# EAGLE schematic Weather_Sensor_Board (EAGLE 7.4.0)
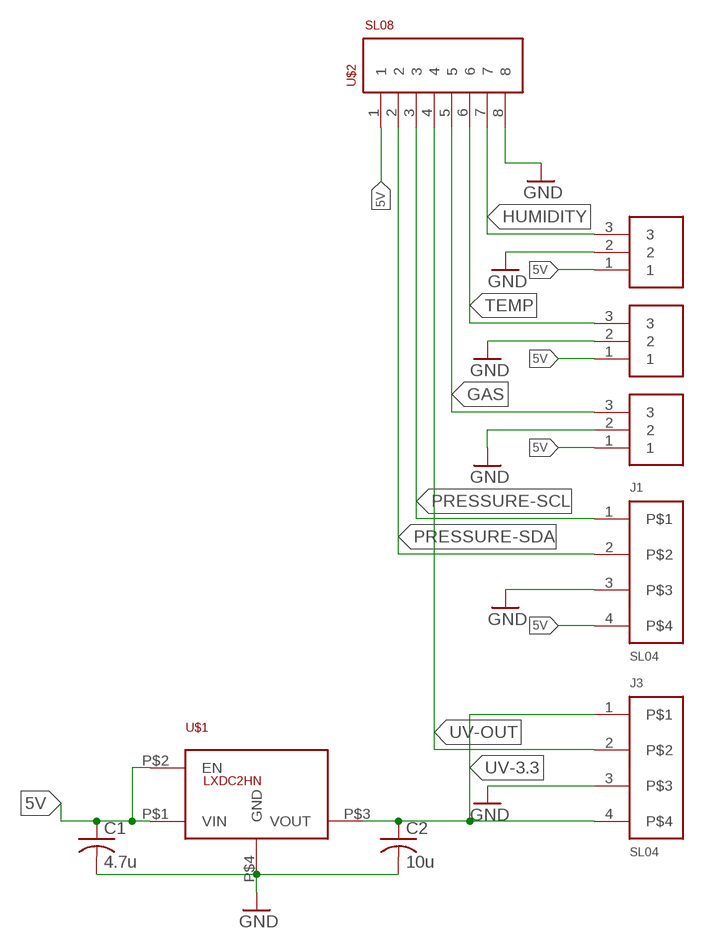
[diagram p0: schematic, sheet 1]

## Parts
C1  4.7u  C-USC0805  [C0805]
C2  10u  C-USC0805  [C0805]
J1  SL04  [MOLEX_SL_04_TH]
J2  SL03THROUGH_HOLE  [MOLEX_SL_03_TH]
J3  SL04  [MOLEX_SL_04_TH]
J4  SL03THROUGH_HOLE  [MOLEX_SL_03_TH]
J5  SL03THROUGH_HOLE  [MOLEX_SL_03_TH]
U$1  LXDC2HN  [4-SMD]
U$2  SL08  [MOLEX-70543-0007]

## Nets
5V: C1.1 J1.4 J2.1 J4.1 J5.1 U$1.P$1(VIN) U$1.P$2(EN)
GAS: J5.3 U$2.5
GND: C1.2 C2.2 J1.3 J2.2 J3.3 J4.2 J5.2 U$1.P$4(GND) U$2.8
HUMIDITY: J2.3 U$2.7
PRESSURE-SCL: J1.1 U$2.3
PRESSURE-SDA: J1.2 U$2.2
TEMP: J4.3 U$2.6
UV-3.3: C2.1 J3.1 J3.4 U$1.P$3(VOUT)
UV-OUT: J3.2 U$2.4
Unconnected: U$2.1

## Library data of the parts
C1 C2 = rcl:C-US: CAPACITOR, American symbol
J1 J3 = MRDT-Connectors:SL04
J2 J4 J5 = MRDT-Connectors:SL03: Molex 3-pin SL connector Locking 3 pin connector with standard header spacing. Backward compatible with standard RC servo connectors.; ORIENT: HORIZ; PARTNO: 0705550002
U$1 = MRDT-ICs:LXDC2HN
U$2 = MRDT-Connectors:SL08